# Altium schematic sheet Schematic.SchDoc
size A4
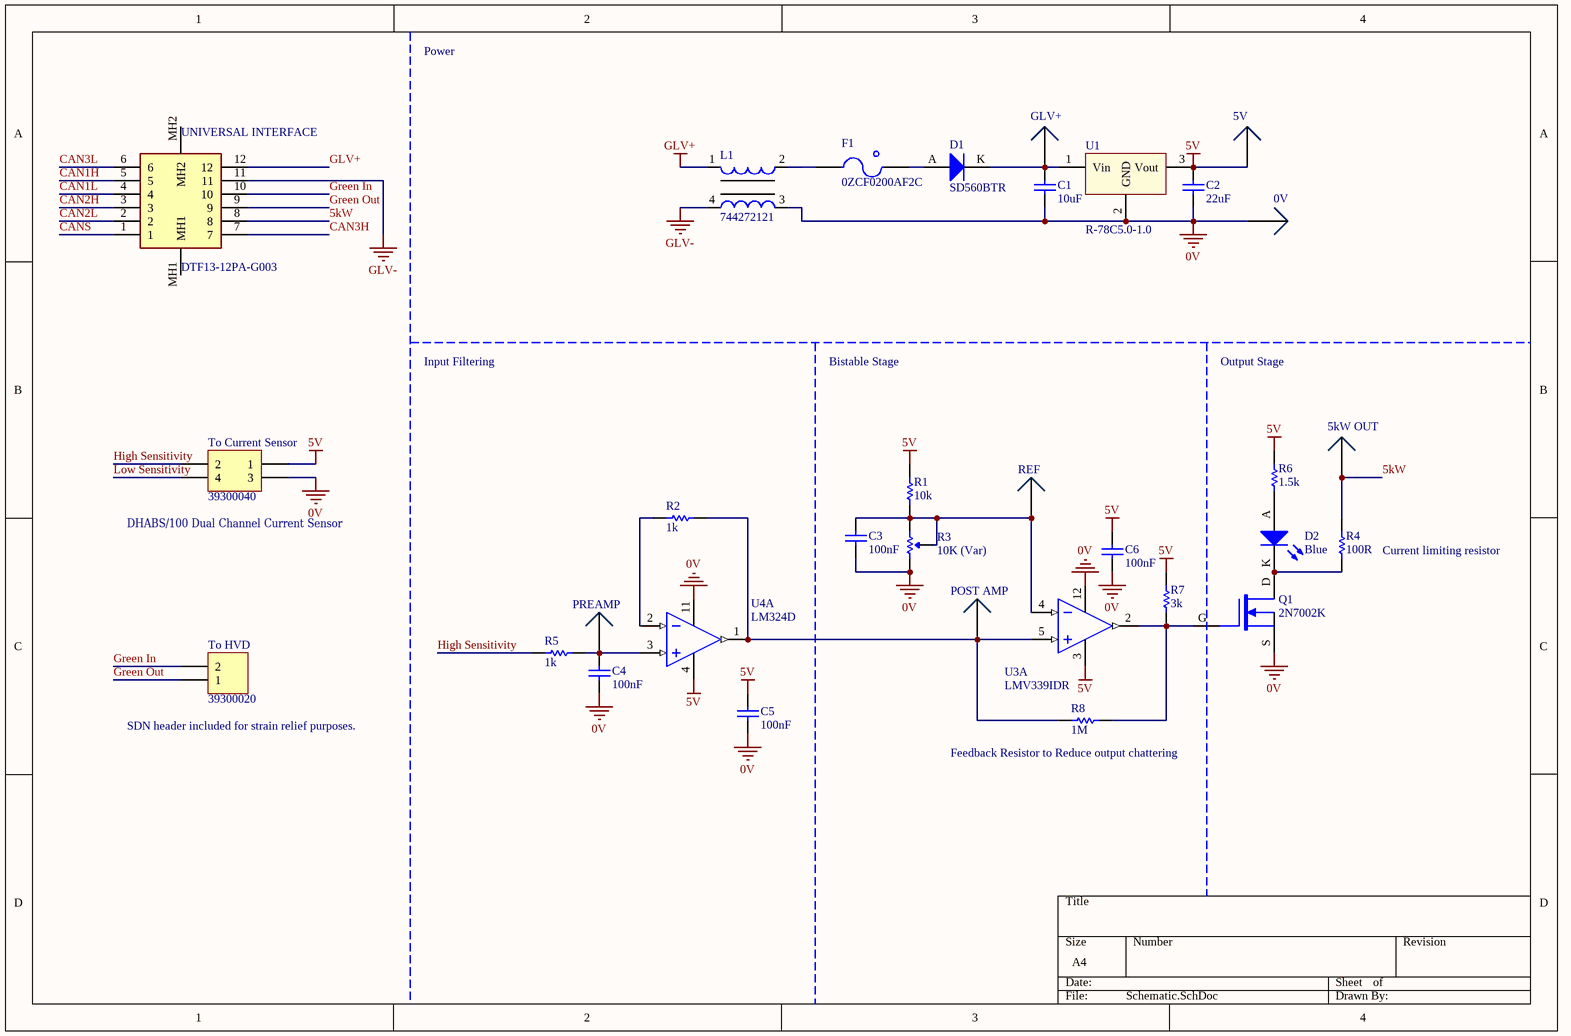
[diagram p0: Schematic.SchDoc]

## Parts
0V  0mm  [TH Test Point]  (value not drawn)
5kW_OUT  0mm  [TH Test Point]  (value not drawn)
5V  0mm  [TH Test Point]  (value not drawn)
C1  10uF  [0805]
C2  22uF  [1206]
C3  100nF  [0805]
C4  100nF  [0805]
C5  100nF  [0805]
C6  100nF  [0805]
D1  SD560BTR  [SMB Diode]
D2  Blue  [0805 LED]
F1  0ZCF0200AF2C  [2920]
GLV+  0mm  [TH Test Point]  (value not drawn)
L1  744272121  [WE-SL5]
POST_AMP  0mm  [TH Test Point]  (value not drawn)
PREAMP  0mm  [TH Test Point]  (value not drawn)
Q1  2N7002K  [ON SOT-23 MOSFET]
R1  10k  [0805]
R2  1k  [0805]
R3  10K (Var)  [B 3296]
R4  100R  [0805]
R5  1k  [0805]
R6  1.5k  [0805]
R7  3k  [0805]
R8  1M  [0805]
REF  0mm  [TH Test Point]  (value not drawn)
To_Current_Sensor  39300040  [39300040]
To_HVD  39300020  [39300020]
U1  R-78C5.0-1.0  [RECOM 3-SIP]
U3  LMV339IDR  [TI 14-SOIC]  (part A of 4)
U4  LM324D  [TI 14-SOIC]  (part A of 4)
UNIVERSAL_INTERFACE  DTF13-12PA-G003  [DTF1312PAG003]

## Nets
0V: 0V.1 C1.1 C2.1 C3.1 C4.1 C5.1 C6.1 L1.3 Q1.S R3.3(CW) To_Current_Sensor.3 U1.2(GND) U3.12(V-) U4.11(GND)
5V: 5V.1 C2.2 C5.2 C6.2 R1.2 R6.2 R7.2 To_Current_Sensor.1 U1.3(Vout) U3.3(V+) U4.4(VCC)
GLV+: L1.1 UNIVERSAL_INTERFACE.12
GLV-: L1.4 UNIVERSAL_INTERFACE.11
5kW: 5kW_OUT.1 R4.2 UNIVERSAL_INTERFACE.8
CAN1H: UNIVERSAL_INTERFACE.5
CAN1L: UNIVERSAL_INTERFACE.4
CAN2H: UNIVERSAL_INTERFACE.3
CAN2L: UNIVERSAL_INTERFACE.2
CAN3H: UNIVERSAL_INTERFACE.7
CAN3L: UNIVERSAL_INTERFACE.6
CANS: UNIVERSAL_INTERFACE.1
Green In: To_HVD.2 UNIVERSAL_INTERFACE.10
Green Out: To_HVD.1 UNIVERSAL_INTERFACE.9
High Sensitivity: R5.1 To_Current_Sensor.2
Low Sensitivity: To_Current_Sensor.4
NetC1_2: C1.2 D1.K GLV+.1 U1.1(Vin)
NetC3_2: C3.2 R1.1 R3.1(CCW) R3.2(Wiper) REF.1 U3.4(IN_A-)
NetC4_2: C4.2 PREAMP.1 R5.2 U4.3(1IN+)
NetD1_A: D1.A F1.2
NetD2_A: D2.A R6.1
NetD2_K: D2.K Q1.D R4.1
NetF1_1: F1.1 L1.2
NetPOST_AMP_1: POST_AMP.1 R2.2 R8.1 U3.5(IN_A+) U4.1(1OUT)
NetQ1_G: Q1.G R7.1 R8.2 U3.2(OUT_A)
NetR2_1: R2.1 U4.2(1IN+)

Not connected (* = marked no-connect by the designer): UNIVERSAL_INTERFACE MH1 MH2

## Notes on the sheet
- Power
- Input Filtering
- Bistable Stage
- Output Stage
- (near To_Current_Sensor) DHAB​​S/100 Dual Channel Current Sensor
- (near R4) Current limiting resistor
- (near To_HVD) SDN header included for strain relief purposes.
- (near R8) Feedback Resistor to Reduce output chattering

## Library data of the parts
0V 5kW_OUT 5V GLV+ POST_AMP PREAMP REF = TH Test Point: Positions: 1; Angle: 0; Flange: No; Contact: NA; Part Number: TH Test Point; Pitch: 0mm; Row Spacing: 0mm
C1 = GRM21BR6YA106KE43L: Manufacturer: muRata; Tolerance: 10%; Material: X5R; Rated Voltage: 50V; Part Number: GRM21BR6YA106KE43L; Value: 10uF; Digikey Part Number: 490-10514-6-ND
C2 = CC1206MKX5R7BB226: Manufacturer: YAGEO; Tolerance: 20%; Material: Ceramic; Rated Voltage: 16V; Part Number: CC1206MKX5R7BB226; Value: 22uF; Digikey Part Number: 311-1997-2-ND
C3-C6 = GCM21BR71E104KA37L: Manufacturer: muRata; Tolerance: 10%; Material: X7R; Rated Voltage: 25V; Part Number: GCM21BR71E104KA37L; Value: 100nF
D1 = SD560BTR: 1.2V_F 600V 5A SMB; Manufacturer: SMC Diode Solutions; Part Number: SD560BTR; Digikey Part Number: 1655-1530-2-ND; Digikey Link: https://www.digikey.com/product-detail/en/smc-diode-solutions/SD560BTR/1655-1530-2-ND/6022620
D2 = SML-MN2BCTT86C: LED BLUE CLEAR 2012 SMD; Manufacturer: ROHM Semiconductor; Part Number: SML-MN2BCTT86C; Colour: Blue; Digikey Part Number: 846-1207-1-ND; Digikey Link: https://www.digikey.com/product-detail/en/rohm-semiconductor/SMLMN2BCTT86C/846-1207-1-ND/6057239
F1 = 0ZCF0200AF2C: SMD 24V 2A Fuse; Manufacturer: Bel Fuse Inc; Part Number: 0ZCF0200AF2C; Digikey Part Number: 507-1749-2-ND; Digikey Link: https://www.digikey.com/product-detail/en/bel-fuse-inc/0ZCF0200AF2C/507-1749-2-ND/4156090
L1 = CMP-00010-1: CMC 120UH 2.5A 2LN 460 OHM SMD; Voltage Rating (DC): 80V; Inductance Tolerance: 40%; Max Current Rating: 3A; Number of Lines: 2; Test Frequency: 100kHz; Resistance: 25mR; Core Material: Ferrite; Impedance: 460R; Max Operating Temperature: 125°C; Depth: 8.7mm; Min Operating Temperature: -40°C; Current Rating: 2.5A; Tolerance: 40%; Number of Pins: 4; Case/Package: SMD/SMT; Weight: 0.026103oz; Inductance: 120uH; Package Quantity: 1; Current: 2.5A; Width: 0.343inch; RoHS Compliant: Yes; Length: 0.394inch; DC Resistance (DCR): 25mR; Mount: Surface Mount; Termination: SMD/SMT; Packaging: Tape and Reel; Lead Free: Lead Free; Self Resonant Frequency: 100kHz; Height: 6.5mm; Series: WE-SL5; Max DC Current: 2.5A; Voltage Rating: 80V; REACH SVHC: No SVHC
Q1 = 2N7002K: 60V 380mA, NFET MOSTFET (Small Signal); Manufacturer: ON Semiconductor; Published: 24-Mar-1999; LatestRevisionDate: 29-May-2009; LatestRevisionNote: IPC-7351 Footprint Added.; PackageVersion: Sep-2000; PackageReference: SOT-343; Publisher: Altium Limited; PackageDescription: 4-Pin SOT-343 Package 1.3 mm Pitch, 2.1 mm Lead Span; Part Number: 2N7002K; Digikey Part Number: 2N7002KCT-ND; Digikey Link: https://www.digikey.com/product-detail/en/on-semiconductor/2N7002K/2N7002KCT-ND/2060375; Qty: 30
R1 = RC0805FR0710KL: Manufacturer: YAGEO; Tolerance: 0.01; Rated Voltage: 0.125W; Part Number: RC0805FR0710KL; Value: 10k; Material: FR-07
R2 R5 = RC0805FR071KL: Manufacturer: YAGEO; Tolerance: 0.01; Rated Voltage: 0.125W; Part Number: RC0805FR071KL; Value: 1k; Material: FR-07
R3 = 3296W-1-103LF: Manufacturer: Bournes Inc; Tolerance: 0.1; Rated Voltage: 0.5W; Part Number: 3296W-1-103LF; Value: 10K (Var); Digikey Part Number: 3296W-103LF-ND
R4 = RC0805FR07100RL: Manufacturer: YAGEO; Tolerance: 0.01; Rated Voltage: 0.125W; Part Number: RC0805FR07100RL; Value: 100R; Material: FR-07
R6 = RC0805FR071K5L: Manufacturer: YAGEO; Tolerance: 0.01; Rated Voltage: 0.125W; Part Number: RC0805FR071K5L; Value: 1.5k; Material: FR-07
R7 = RC0805FR073KL: Manufacturer: YAGEO; Tolerance: 0.01; Rated Voltage: 0.125W; Part Number: RC0805FR073KL; Value: 3k; Material: FR-07
R8 = RC0805FR071ML: Manufacturer: YAGEO; Tolerance: 0.01; Rated Voltage: 0.125W; Part Number: RC0805FR071ML; Value: 1M; Material: FR-07; Digikey Part Number: 311-1.00MCRCT-ND
To_Current_Sensor = 39300040: Pitch: 4.2mm; Row Spacing: 5.5mm; Angle: 90; Flange: No; Contact: Tin; Part Number: 39300040; Positions: 4; Digikey Part Number: WM21352-ND
To_HVD = 39300020: Pitch: 4.2mm; Row Spacing: 5.5mm; Angle: 90; Flange: No; Contact: Tin; Part Number: 39300020; Positions: 2; Digikey Part Number: WM21351-ND
U1 = R-78C5.0-1.0: CONV DC/DC 1A 5V OUT SIP VERT; Manufacturer: Recom; Isolation: Non-Isolated; Part Number: R-78C5.0-1.0; Digikey Part Number: 945-1395-5-ND; Digikey Link: https://www.digikey.com.au/product-detail/en/recom-power/R-78C5.0-1.0/945-1395-5-ND/2652148
U3 = LMV339IDR: Comparator General Purpose Open Collector 14-SOIC; Manufacturer: Texas Instruments; Part Number: LMV339IDR; Digikey Part Number: 296-6611-2-ND; Digikey Link: https://www.digikey.com/product-detail/en/texas-instruments/LMV339MTX-NOPB/296-35446-1-ND/3739150
U4 = LM324D: IC OPAMP GP 4 CIRCUIT 14SOIC; Manufacturer: Texas Instruments; Part Number: LM324D; Digikey Part Number: 296-1390-5-ND; Digikey Link: https://www.digikey.com/product-detail/en/texas-instruments/LM324D/296-1390-5-ND/277039
UNIVERSAL_INTERFACE = DTF13-12PA-G003: Connector; Manufacturer_Name: TE Connectivity; Datasheet Link: https://www.te.com/commerce/DocumentDelivery/DDEController?Action=showdoc&DocId=Customer+Drawing%7FDTF13-12PX-G003%7F-%7Fpdf%7FEnglish%7FENG_CD_DTF13-12PX-G003_-.pdf%7FDTF13-12PA-G003; Height: 23.01mm; Manufacturer_Part_Number: DTF13-12PA-G003; Mouser Part Number: 571-DTF13-12PA-G003; Mouser Price/Stock: https://www.mouser.co.uk/ProductDetail/TE-Connectivity-DEUTSCH/DTF13-12PA-G003?qs=cgQJD%2FpJz0zeSgV%2FZpdzbg%3D%3D